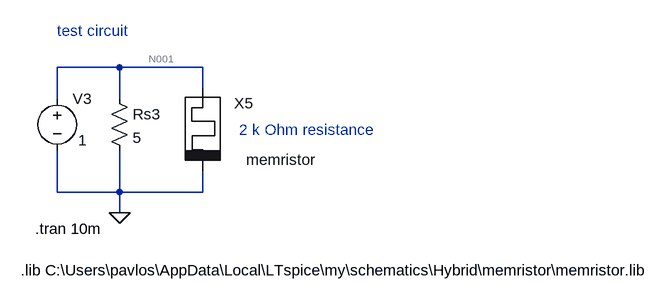
[diagram p0: schematic Simulation _w_lib_file.asc]
Simulation _w_lib_file.asc, the LTspice schematic file:
Version 4
SHEET 1 2596 748
WIRE 112 -768 16 -768
WIRE 240 -768 112 -768
WIRE 240 -736 240 -768
WIRE 16 -720 16 -768
WIRE 112 -720 112 -768
WIRE 16 -576 16 -640
WIRE 112 -576 112 -640
WIRE 112 -576 16 -576
WIRE 240 -576 240 -608
WIRE 240 -576 112 -576
WIRE 112 -544 112 -576
FLAG 112 -544 0
SYMBOL memristor 240 -672 R0
WINDOW 3 67 46 Left 2
WINDOW 39 596 -83 Left 2
WINDOW 0 48 -41 Left 2
SYMATTR InstName X5
SYMBOL voltage 16 -736 R0
WINDOW 123 0 0 Left 0
WINDOW 39 0 0 Left 0
WINDOW 3 32 80 Left 2
SYMATTR Value 1
SYMATTR InstName V3
SYMBOL res 96 -736 R0
SYMATTR InstName Rs3
SYMATTR Value 5
TEXT 296 -672 Left 2 ;2 k Ohm resistance
TEXT 16 -824 Left 2 ;test circuit
TEXT -18 -520 Left 2 !.tran 10m
TEXT -40 -456 Left 2 !.lib C:\\Users\\pavlos\\AppData\\Local\\LTspice\\my\\schematics\\Hybrid\\memristor\\memristor.lib

The netlist it stands for:
* Simulation _w_lib_file.asc
XX5 N001 0 memristor  ; pins plus minus
V3 N001 0 1
Rs3 N001 0 5
* 2 k Ohm resistance
* test circuit
.tran 10m
.lib C:\Users\pavlos\AppData\Local\LTspice\my\schematics\Hybrid\memristor\memristor.lib
.backanno
.end

* Results of the author's LTspice run, read from the files saved beside the schematic
* Operating Point, zero values left out:
*   V(n001) = 1 V
*   I(Rs3) = 200 mA
*   I(V3) = -200.5 mA
*   Ix(x5:1) = 479.9 µA
*   Ix(x5:2) = -479.9 µA